# Altium schematic sheet NXP_USB_Programmer.SchDoc
size B
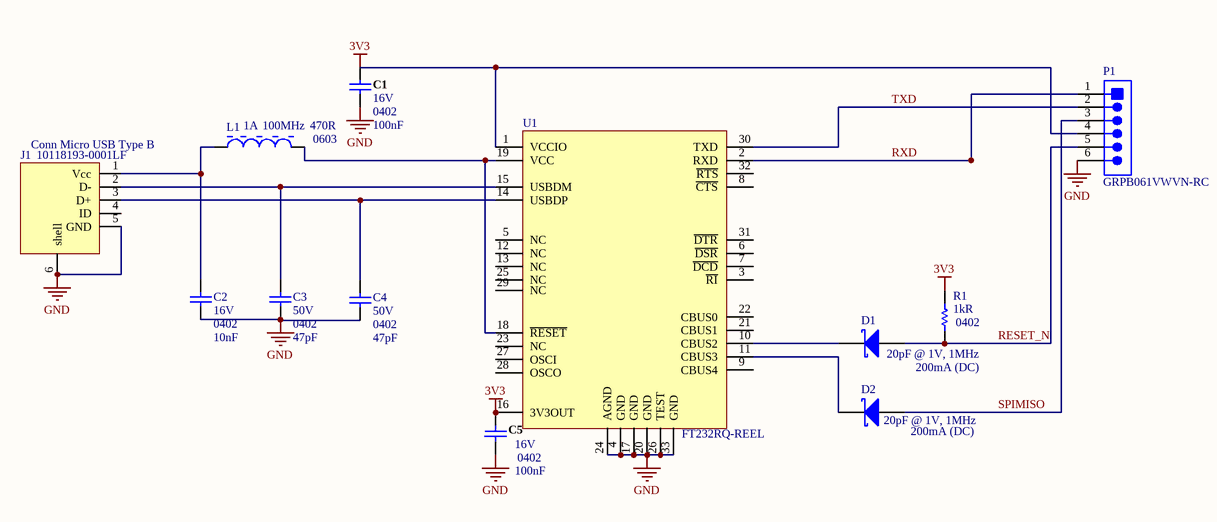
[diagram p0: NXP_USB_Programmer.SchDoc]

## Parts
C1  Voltage Rating: 16V  Case/Package: 0402  Capacitance: 100nF  [SM0402]  (hidden comment: CAP CER 0.1UF 16V X7R 0402)
C2  Voltage Rating: 16V  Case/Package: 0402  Capacitance: 10nF  [SM0402]  (hidden comment: CAP CER 10000PF 16V X7R 0402)
C3  Voltage Rating: 50V  Case/Package: 0402  Capacitance: 47pF  [SM0402]  (hidden comment: CAP CER 47PF 50V NP0 0402)
C4  Voltage Rating: 50V  Case/Package: 0402  Capacitance: 47pF  [SM0402]  (hidden comment: CAP CER 47PF 50V NP0 0402)
C5  Voltage Rating: 16V  Case/Package: 0402  Capacitance: 100nF  [SM0402]  (hidden comment: CAP CER 0.1UF 16V X7R 0402)
D1  Capacitance @ Vr, F: 20pF @ 1V, 1MHz  Current - Average Rectified (Io): 200mA (DC)  [DIODE SOD523]  (hidden comment: DIODE SCHOTTKY 30V 200MA SOD523)
D2  Capacitance @ Vr, F: 20pF @ 1V, 1MHz  Current - Average Rectified (Io): 200mA (DC)  [DIODE SOD523]  (hidden comment: DIODE SCHOTTKY 30V 200MA SOD523)
J1  Description2: Conn Micro USB Type B  [FCI-10118193-0001LF-5_V]  (hidden comment: 10118193-0001LF)
L1  Max Current Rating: 1A  Test Frequency: 100MHz  Impedance: 470R  Case/Package: 0603  [BLM18PG471SN1D]  (hidden comment: FERRITE BEAD 470 OHM 0603 1LN)
P1  CONN HEADER VERT 6POS 1.27MM  [SLIN-GRPB061VWVN-RC_V]  (value not drawn)
R1  Resistance: 1kR  Case/Package: 0402  [SM0402]  (hidden comment: RES 1K OHM 0.5% 1/16W 0402)
U1  FT232RQ-REEL  [COM-UART-FT232R-SQ32]

## Nets
3V3: C1.2 C5.2 P1.4 R1.2 U1.1(VCCIO) U1.16(3V3OUT)
GND: C1.1 C2.1 C3.1 C4.1 C5.1 J1.5(GND) J1.6(shell) P1.6 U1.4(GND) U1.17(GND) U1.20(GND) U1.24(AGND) U1.26(TEST) U1.33(GND)
RESET_N: D1.1(A) P1.5 R1.1
RXD: P1.1 U1.2(RXD)
SPIMISO: D2.1(A) P1.3
TXD: P1.2 U1.30(TXD)
NetC2_2: C2.2 J1.1(Vcc) L1.1
NetC3_2: C3.2 J1.2(D-) U1.15(USBDM)
NetC4_2: C4.2 J1.3(D+) U1.14(USBDP)
NetD1_2: D1.2(K) U1.10(CBUS2)
NetD2_2: D2.2(K) U1.11(CBUS3)
NetL1_2: L1.2 U1.18(~{RESET}) U1.19(VCC)

Not connected (* = marked no-connect by the designer): J1 4(ID); U1 3(~{RI}) 5(NC) 6(~{DSR}) 7(~{DCD}) 8(~{CTS}) 9(CBUS4) 12(NC) 13(NC) 21(CBUS1) 22(CBUS0) 23(NC) 25(NC) 27(OSCI) 28(OSCO) 29(NC) 31(~{DTR}) 32(~{RTS})

## Notes on the sheet
- Title
- Size:
- Date:
- B
- Number:
- Time:
- Revision:
- Sheet
- of
- File:

## Library data of the parts
C1 C5 = CC0402KRX7R7BB104: 0.1µF ±10% 16V Ceramic Capacitor X7R 0402 (1005 Metric); Manufacturer: Yageo; ComponentLink1Description: CC0402KRX7R7BB104; ComponentLink1URL: https://www.digikey.com/products/en/capacitors/ceramic-capacitors/60?k=CC0402KRX7R7BB104&k=&pkeyword=CC0402KRX7R7BB104&sv=0&pv7=2&sf=0&quantity=&ColumnSort=0&page=1&pageSize=25; ComponentLink2URL: https://datasheet.ciiva.com/11788/0900766b80ce67ed-11788364.pdf?src-supplier=RSComponents; ComponentLink2Description: https://datasheet.ciiva.com/11788/0900766b80ce67ed-11788364.pdf?src-supplier=RSComponents; ComponentLink3URL: https://datasheet.ciiva.com/16625/upy-gphc-x7r-6-3v-to-50v-8-16625511.pdf?src-supplier=Avnet+Europe; ComponentLink3Description: https://datasheet.ciiva.com/16625/upy-gphc-x7r-6-3v-to-50v-8-16625511.pdf?src-supplier=Avnet+Europe; ComponentLink4URL: https://datasheet.ciiva.com/161/mlccorderingcode-161544.pdf?src-supplier=Digi-Key; ComponentLink4Description: https://datasheet.ciiva.com/161/mlccorderingcode-161544.pdf?src-supplier=Digi-Key; ComponentLink5URL: https://datasheet.ciiva.com/161/mlccorderingcode-161545.pdf?src-supplier=Digi-Key; ComponentLink5Description: https://datasheet.ciiva.com/161/mlccorderingcode-161545.pdf?src-supplier=Digi-Key; ComponentLink6URL: https://datasheet.ciiva.com/11587/upy-gphc-x7r-6-3v-to-50v-8-11587305.pdf?src-supplier=Avnet; ComponentLink6Description: https://datasheet.ciiva.com/11587/upy-gphc-x7r-6-3v-to-50v-8-11587305.pdf?src-supplier=Avnet; ComponentLink7URL: https://datasheet.ciiva.com/161/mlccorderingcode-161546.pdf?src-supplier=Digi-Key; ComponentLink7Description: https://datasheet.ciiva.com/161/mlccorderingcode-161546.pdf?src-supplier=Digi-Key; ComponentLink8URL: https://datasheet.ciiva.com/13395/upy-gphc-x7r-6-3v-to-50v-8-13395676.pdf?src-supplier=Mouser; ComponentLink8Description: https://datasheet.ciiva.com/13395/upy-gphc-x7r-6-3v-to-50v-8-13395676.pdf?src-supplier=Mouser; ComponentLink9URL: https://datasheet.ciiva.com/8033/1734573-8033661.pdf?src-supplier=Element14; ComponentLink9Description: https://datasheet.ciiva.com/8033/1734573-8033661.pdf?src-supplier=Element14; ComponentLink10URL: https://datasheet.ciiva.com/7978/1489800-7978111.pdf?src-supplier=Element14; ComponentLink10Description: https://datasheet.ciiva.com/7978/1489800-7978111.pdf?src-supplier=Element14; ComponentLink11URL: https://datasheet.ciiva.com/8033/1734573-8033663.pdf?src-supplier=Element14; ComponentLink11Description: https://datasheet.ciiva.com/8033/1734573-8033663.pdf?src-supplier=Element14; ComponentLink12URL: https://datasheet.ciiva.com/28450/1489800-28450335.pdf?src-supplier=Element14; ComponentLink12Description: https://datasheet.ciiva.com/28450/1489800-28450335.pdf?src-supplier=Element14; Supplier 1: Digi-Key; Manufacturer Part Number: CC0402KRX7R7BB104; Stock 1: 38597495; Pricing 1: 1 = 0.10000, 10 = 0.03800, 100 = 0.01700, 500 = 0.01216, 1000 = 0.00956, 2500 = 0.00869, 5000 = 0.00799 (USD); Mount: Surface Mount; Number of Pins: 2; Case Code (Metric): 1005; Min Operating Temperature: -55°C; Max Operating Temperature: 125°C; Tolerance: 10%; Voltage Rating (DC): 16V; Packaging: Tape and Reel; Package Quantity: 1; Dielectric: X7R; Termination: SMD/SMT; Composition: Ceramic; Voltage: 16V; Length: 1mm; Height: 0.5mm; Width: 0.02inch; Thickness: 0.022inch; Depth: 0.5mm; Radiation Hardening: No; REACH SVHC: No SVHC; Lead Free: Lead Free; Halogen Free: Halogen Free; Case Code (Imperial): 0402; Supplier Part Number 1: 311-1338-1-ND
C2 = C0402C103K4RALTU: 10000pF ±10% 16V Ceramic Capacitor X7R 0402 (1005 Metric) /; Manufacturer: KEMET; Tolerance: Â±10%; Value: 10nF; Case-Metric: 1005; Description: Cap Ceramic 0.01uF 16V X7R 10% Pad SMD 0402 125C T/R; Dissipation Factor: 3.5%; Rated Voltage: 16 V; Case-EIA: 0402; Max Thickness: 0.6 mm; Technology: SMT; ComponentLink1Description: C0402C103K4RALTU; ComponentLink1URL: https://www.digikey.com/products/en/capacitors/ceramic-capacitors/60?k=C0402C103K4RALTU&k=&pkeyword=C0402C103K4RALTU&sv=0&pv7=2&sf=0&quantity=&ColumnSort=0&page=1&pageSize=25; Supplier 1: Digi-Key; Manufacturer Part Number: C0402C103K4RALTU; Stock 1: 75494; Pricing 1: 1 = 0.76000, 10 = 0.56400, 100 = 0.38640, 500 = 0.30590, 1000 = 0.25760, 2500 = 0.24150, 5000 = 0.23345 (USD); Mount: Surface Mount; Case Code (Metric): 1005; Dielectric Material: Ceramic; Min Operating Temperature: -55°C; Max Operating Temperature: 125°C; Packaging: Tape and Reel; Package Quantity: 1; Voltage Rating (DC): 16V; Dielectric: X7R; Termination: SMD/SMT; Length: 1mm; Height: 0.5mm; Width: 0.02inch; Thickness: 0.022inch; Depth: 0.5mm; Radiation Hardening: No; ComponentLink2URL: http://components.arrow.com/part/dataview/46124281S9906155N7429?src-supplier=Arrow; ComponentLink2Description: http://components.arrow.com/part/dataview/46124281S9906155N7429?src-supplier=Arrow; ComponentLink3URL: http://www.mouser.com/ds/2/212/KEM_C1018_X7R_SnPb_SMD-1102795.pdf?src-supplier=Mouser; ComponentLink3Description: http://www.mouser.com/ds/2/212/KEM_C1018_X7R_SnPb_SMD-1102795.pdf?src-supplier=Mouser; ComponentLink4URL: https://search.kemet.com/component-edge/download/datasheet/C0402C103K4RALTU.pdf?src-supplier=Digi-Key; ComponentLink4Description: https://search.kemet.com/component-edge/download/datasheet/C0402C103K4RALTU.pdf?src-supplier=Digi-Key; ComponentLink5URL: https://api.kemet.com/component-edge/download/datasheet/C0402C103K4RALTU.pdf?src-supplier=Digi-Key; ComponentLink5Description: https://api.kemet.com/component-edge/download/datasheet/C0402C103K4RALTU.pdf?src-supplier=Digi-Key; ComponentLink6URL: http://datasheet.octopart.com/C0402C103K4RALTU-Kemet-datasheet-62307648.pdf?src-supplier=Element14; ComponentLink6Description: http://datasheet.octopart.com/C0402C103K4RALTU-Kemet-datasheet-62307648.pdf?src-supplier=Element14; ComponentLink7URL: http://datasheet.octopart.com/C0402C103K4RALTU-KEMET-datasheet-83561409.pdf?src-supplier=Newark; ComponentLink7Description: http://datasheet.octopart.com/C0402C103K4RALTU-KEMET-datasheet-83561409.pdf?src-supplier=Newark; ComponentLink8URL: http://datasheet.octopart.com/C0402C103K4RALTU-KEMET-datasheet-86448208.pdf?src-supplier=Farnell; ComponentLink8Description: http://datasheet.octopart.com/C0402C103K4RALTU-KEMET-datasheet-86448208.pdf?src-supplier=Farnell; ComponentLink9URL: http://datasheet.octopart.com/C0402C103K4RALTU-KEMET-datasheet-84169754.pdf; ComponentLink9Description: http://datasheet.octopart.com/C0402C103K4RALTU-KEMET-datasheet-84169754.pdf; Case Code (Imperial): 0402; Supplier Part Number 1: 399-6340-1-ND
C3 C4 = C0402C470D5GACTU: 47pF ±0.5pF 50V Ceramic Capacitor C0G, NP0 0402 (1005 Metric); Manufacturer: KEMET; ComponentLink1Description: C0402C470D5GACTU; ComponentLink1URL: https://www.digikey.com/product-detail/en/C0402C470D5GACTU/C0402C470D5GACTU-ND/2196707?utm_campaign=buynow&WT.z_cid=ref_octopart_dkc_buynow&utm_medium=aggregator&curr=usd&site=us&utm_source=octopart; Supplier 1: Digi-Key; Manufacturer Part Number: C0402C470D5GACTU; Stock 1: 0; Pricing 1: 10000 = 0.39203 (USD); Mount: Surface Mount; Case Code (Metric): 1005; Dielectric Material: Ceramic; Min Operating Temperature: -55°C; Max Operating Temperature: 125°C; Package Quantity: 10000; Packaging: Tape and Reel; Voltage Rating (DC): 50V; Dielectric: C0G; Termination: SMD/SMT; Length: 0.039inch; Height: 0.5mm; Width: 0.02inch; Thickness: 0.022inch; Lead Pitch: 0.3mm; Lead Free: Lead Free; ComponentLink2URL: https://datasheet.ciiva.com/5421/kem-c1003-c0g-smd-5421883.pdf?src-supplier=Mouser; ComponentLink2Description: https://datasheet.ciiva.com/5421/kem-c1003-c0g-smd-5421883.pdf?src-supplier=Mouser; ComponentLink3URL: http://datasheet.octopart.com/C0402C470D5GACTU-KEMET-datasheet-84169754.pdf; ComponentLink3Description: http://datasheet.octopart.com/C0402C470D5GACTU-KEMET-datasheet-84169754.pdf; Supplier Part Number 1: C0402C470D5GACTU-ND; Case Code (Imperial): 0402
D1 D2 = RB521S30,115: Schottky Barrier Diode, 30 V, 0.2 A, -55 to 125 degC, 2-Pin SOD523F, RoHS, Tape and Reel; Manufacturer: Nexperia; ComponentLink1Description: RB521S30,115; ComponentLink1URL: https://www.digikey.com/product-detail/en/nexperia-usa-inc/RB521S30115/1727-6493-1-ND/2773925; ComponentLink2URL: http://datasheet.octopart.com/RB521S30%2C115-Nexperia-datasheet-87582339.pdf?src-supplier=Nexperia; ComponentLink2Description: http://datasheet.octopart.com/RB521S30%2C115-Nexperia-datasheet-87582339.pdf?src-supplier=Nexperia; ComponentLink3URL: http://datasheet.octopart.com/RB521S30%2C115-Nexperia-datasheet-10674343.pdf?src-supplier=NXP+Semiconductors; ComponentLink3Description: http://datasheet.octopart.com/RB521S30%2C115-Nexperia-datasheet-10674343.pdf?src-supplier=NXP+Semiconductors; ComponentLink4URL: http://datasheet.octopart.com/RB521S30%2C115-Philips-datasheet-14055121.pdf?src-supplier=IIIC; ComponentLink4Description: http://datasheet.octopart.com/RB521S30%2C115-Philips-datasheet-14055121.pdf?src-supplier=IIIC; Supplier 1: Digi-Key; Manufacturer Part Number: RB521S30,115; Stock 1: 15636; Pricing 1: 1 = 0.27000, 10 = 0.22100, 100 = 0.11740, 500 = 0.07726, 1000 = 0.05253 (USD); Supplier Part Number 1: 1727-6493-1-ND
J1 = 10118193-0001LF: USB - micro B USB 2.0 Receptacle Connector 5 Position Surface Mount, Right Angle; Through Hole; Manufacturer: Amphenol ICC; ComponentLink1Description: 609-4616-1-ND; ComponentLink1URL: https://www.digikey.com/products/en/connectors-interconnects/usb-dvi-hdmi-connectors/312?k=10118193-0001LF&k=&pkeyword=10118193-0001LF&sv=0&pv7=2&sf=0&quantity=&ColumnSort=0&page=1&pageSize=25; ComponentLink2URL: http://datasheet.octopart.com/10118193-0001LF-FCI-datasheet-55953155.pdf?src-supplier=TME; ComponentLink2Description: http://datasheet.octopart.com/10118193-0001LF-FCI-datasheet-55953155.pdf?src-supplier=TME; ComponentLink3URL: http://datasheet.octopart.com/10118193-0001LF-FCI-datasheet-11792339.pdf?src-supplier=Arrow; ComponentLink3Description: http://datasheet.octopart.com/10118193-0001LF-FCI-datasheet-11792339.pdf?src-supplier=Arrow; ComponentLink4URL: http://datasheet.octopart.com/10118193-0001LF-FCI-datasheet-13702206.pdf?src-supplier=Allied+Electronics; ComponentLink4Description: http://datasheet.octopart.com/10118193-0001LF-FCI-datasheet-13702206.pdf?src-supplier=Allied+Electronics; ComponentLink5URL: http://datasheet.octopart.com/10118193-0001LF-Amphenol-datasheet-96019471.pdf?src-supplier=Newark; ComponentLink5Description: http://datasheet.octopart.com/10118193-0001LF-Amphenol-datasheet-96019471.pdf?src-supplier=Newark; ComponentLink6URL: http://datasheet.octopart.com/10118193-0001LF-Amphenol-ICC-datasheet-96019471.pdf?src-supplier=Element14; ComponentLink6Description: http://datasheet.octopart.com/10118193-0001LF-Amphenol-ICC-datasheet-96019471.pdf?src-supplier=Element14; ComponentLink7URL: http://datasheet.octopart.com/10118193-0001LF-Amphenol-ICC-datasheet-55953155.pdf?src-supplier=Future+Electronics; ComponentLink7Description: http://datasheet.octopart.com/10118193-0001LF-Amphenol-ICC-datasheet-55953155.pdf?src-supplier=Future+Electronics; ComponentLink8URL: http://datasheet.octopart.com/10118193-0001LF-Amphenol-ICC-datasheet-116246833.pdf?src-supplier=Future+Electronics; ComponentLink8Description: http://datasheet.octopart.com/10118193-0001LF-Amphenol-ICC-datasheet-116246833.pdf?src-supplier=Future+Electronics; ComponentLink9URL: http://datasheet.octopart.com/10118193-0001LF-ICC-datasheet-96019471.pdf?src-supplier=Farnell; ComponentLink9Description: http://datasheet.octopart.com/10118193-0001LF-ICC-datasheet-96019471.pdf?src-supplier=Farnell; ComponentLink10URL: http://datasheet.octopart.com/10118193-0001LF-ICC-datasheet-55953155.pdf?src-supplier=Farnell; ComponentLink10Description: http://datasheet.octopart.com/10118193-0001LF-ICC-datasheet-55953155.pdf?src-supplier=Farnell; Supplier 1: Arrow Electronics Inc.; Stock 1: 8400; Pricing 1: 1200 = 0.20150, 2400 = 0.18370, 4800 = 0.17130, 9600 = 0.15910, 24000 = 0.15810, 1 = 0.42060, 10 = 0.30000, 25 = 0.29990, 100 = 0.28820, 250 = 0.28160, 500 = 0.24750, 1000 = 0.24300, 3000 = 0.19000, 6000 = 0.17370 (USD); Supplier Part Number 1: 10118193-0001LF; Manufacturer Part Number: 10118193-0001LF
L1 = BLM18PG471SN1D: 470 Ohms @ 100MHz 1 Power Line Ferrite Bead 0603 (1608 Metric) 1A 200mOhm; Manufacturer: Murata; Material: Steel; Tolerance: 25%; Resistance: 200mR; Number of Lines: 1; ComponentLink2Description: Datasheet; ComponentLink3URL: http://www.murata.com/products/catalog/pdf/c31e.pdf; ComponentLink1URL: http://www.murata.com/; ComponentLink3Description: Package Specification; ComponentLink2URL: http://www.murata.com/products/catalog/pdf/c31e.pdf; ComponentLink1Description: Manufacturer URL; ComponentLink4Description: BLM18PG471SN1D; ComponentLink4URL: https://www.digikey.com/products/en/filters/ferrite-beads-and-chips/841?k=BLM18PG471SN1D&k=&pkeyword=BLM18PG471SN1D&sv=0&pv7=2&sf=0&quantity=&ColumnSort=0&page=1&pageSize=25; Supplier 1: Digi-Key; Manufacturer Part Number: BLM18PG471SN1D; Stock 1: 2280; Pricing 1: 1 = 0.10000, 10 = 0.07600, 25 = 0.06840, 50 = 0.05000, 100 = 0.04330, 250 = 0.03416, 500 = 0.02884, 1000 = 0.02429 (USD); Number of Pins: 2; Core Material: Ferrite; Case Code (Metric): 1608; Case Code (Imperial): 0603; Min Operating Temperature: -55°C; Max Operating Temperature: 125°C; Package Quantity: 1; Packaging: Tape and Reel; Current Rating: 1A; Max DC Current: 1A; DC Resistance (DCR): 200mR; Termination: SMD/SMT; DC Current: 1A; Military Standard: Not; Number of Circuits: 1; Length: 1.6mm; Height: 0.8mm; Width: 0.8mm; Depth: 0.8mm; Radiation Hardening: No; REACH SVHC: No SVHC; Lead Free: Lead Free; ComponentLink5URL: https://datasheet.ciiva.com/11800/0900766b81275ca5-11800885.pdf?src-supplier=RSComponents; ComponentLink5Description: https://datasheet.ciiva.com/11800/0900766b81275ca5-11800885.pdf?src-supplier=RSComponents; ComponentLink6URL: https://datasheet.ciiva.com/8021/1740433-8021497.pdf?src-supplier=Element14; ComponentLink6Description: https://datasheet.ciiva.com/8021/1740433-8021497.pdf?src-supplier=Element14; ComponentLink7URL: https://datasheet.ciiva.com/6212/l0110s0100blm18p-6212508.pdf?src-supplier=Digi-Key; ComponentLink7Description: https://datasheet.ciiva.com/6212/l0110s0100blm18p-6212508.pdf?src-supplier=Digi-Key; ComponentLink8URL: https://datasheet.ciiva.com/6212/l0110s0100blm18p-6212509.pdf?src-supplier=Digi-Key; ComponentLink8Description: https://datasheet.ciiva.com/6212/l0110s0100blm18p-6212509.pdf?src-supplier=Digi-Key; ComponentLink9URL: https://datasheet.ciiva.com/16331/l0110s0100blm18p-16331542.pdf?src-supplier=Future+Electronics; ComponentLink9Description: https://datasheet.ciiva.com/16331/l0110s0100blm18p-16331542.pdf?src-supplier=Future+Electronics; ComponentLink10URL: https://datasheet.ciiva.com/6212/l0110s0100blm18p-6212506.pdf?src-supplier=Digi-Key; ComponentLink10Description: https://datasheet.ciiva.com/6212/l0110s0100blm18p-6212506.pdf?src-supplier=Digi-Key; ComponentLink11URL: https://datasheet.ciiva.com/8021/1740433-8021498.pdf?src-supplier=Element14; ComponentLink11Description: https://datasheet.ciiva.com/8021/1740433-8021498.pdf?src-supplier=Element14; ComponentLink12URL: https://datasheet.ciiva.com/14122/blm-series-eng-tds-14122876.pdf?src-supplier=Distrelec; ComponentLink12Description: https://datasheet.ciiva.com/14122/blm-series-eng-tds-14122876.pdf?src-supplier=Distrelec; ComponentLink13URL: https://datasheet.ciiva.com/8508/l0110s0100blm18p-8508303.pdf?src-supplier=Avnet; ComponentLink13Description: https://datasheet.ciiva.com/8508/l0110s0100blm18p-8508303.pdf?src-supplier=Avnet; ComponentLink14URL: http://datasheet.octopart.com/BLM18PG471SN1D-Murata-datasheet-11754816.pdf?src-supplier=Element14; ComponentLink14Description: http://datasheet.octopart.com/BLM18PG471SN1D-Murata-datasheet-11754816.pdf?src-supplier=Element14; ComponentLink15URL: http://datasheet.octopart.com/BLM18PG471SN1D-Murata-datasheet-8326388.pdf?src-supplier=_legacy+Avnet; ComponentLink15Description: http://datasheet.octopart.com/BLM18PG471SN1D-Murata-datasheet-8326388.pdf?src-supplier=_legacy+Avnet; ComponentLink16URL: http://datasheet.octopart.com/BLM18PG471SN1D-Murata-datasheet-503348.pdf?src-supplier=_legacy+Avnet; ComponentLink16Description: http://datasheet.octopart.com/BLM18PG471SN1D-Murata-datasheet-503348.pdf?src-supplier=_legacy+Avnet; ComponentLink17URL: http://datasheet.octopart.com/BLM18PG471SN1D-Murata-datasheet-35449.pdf?src-supplier=Farnell; ComponentLink17Description: http://datasheet.octopart.com/BLM18PG471SN1D-Murata-datasheet-35449.pdf?src-supplier=Farnell; ComponentLink18URL: http://datasheet.octopart.com/BLM18PG471SN1D-Murata-datasheet-62086344.pdf?src-supplier=Future+Electronics; ComponentLink18Description: http://datasheet.octopart.com/BLM18PG471SN1D-Murata-datasheet-62086344.pdf?src-supplier=Future+Electronics; ComponentLink19URL: http://datasheet.octopart.com/BLM18PG471SN1D-Murata-datasheet-62117746.pdf?src-supplier=TME; ComponentLink19Description: http://datasheet.octopart.com/BLM18PG471SN1D-Murata-datasheet-62117746.pdf?src-supplier=TME; ComponentLink20URL: http://datasheet.octopart.com/BLM18PG471SN1D-Murata-datasheet-37129980.pdf; ComponentLink20Description: http://datasheet.octopart.com/BLM18PG471SN1D-Murata-datasheet-37129980.pdf; Supplier Part Number 1: 490-5223-1-ND
P1 = GRPB061VWVN-RC: Connector Header Through Hole 6 position 0.050" (1.27mm); Manufacturer: Sullins; Number of Positions: 6; Connector Type: Male Pin; Pitch: 0.05inch; ComponentLink1Description: GRPB061VWVN-RC; ComponentLink1URL: https://www.digikey.com/products/en?keywords=GRPB061VWVN-RC; Supplier 1: Digi-Key; Stock 1: 23780; Pricing 1: 1 = 0.48000, 10 = 0.44800, 100 = 0.34360, 500 = 0.29880, 1000 = 0.24651, 5000 = 0.21663, 10000 = 0.21580 (USD); Mount: Through Hole; Contact Plating: Gold; Package Quantity: 1; Number of Rows: 1; Packaging: Bulk; Termination: Solder; Contact Mating Length: 0.118inch; Lead Free: Lead Free; ComponentLink2URL: https://datasheet.ciiva.com/726/71-grpb-1vwvn-rc-10957-c-726652.pdf?src-supplier=Digi-Key; ComponentLink2Description: https://datasheet.ciiva.com/726/71-grpb-1vwvn-rc-10957-c-726652.pdf?src-supplier=Digi-Key; ComponentLink3URL: http://datasheet.octopart.com/GRPB061VWVN-RC-Sullins-datasheet-12514290.pdf?src-supplier=Future+Electronics; ComponentLink3Description: http://datasheet.octopart.com/GRPB061VWVN-RC-Sullins-datasheet-12514290.pdf?src-supplier=Future+Electronics; ComponentLink4URL: http://datasheet.octopart.com/GRPB061VWVN-RC-Sullins-datasheet-34148777.pdf?src-supplier=Future+Electronics; ComponentLink4Description: http://datasheet.octopart.com/GRPB061VWVN-RC-Sullins-datasheet-34148777.pdf?src-supplier=Future+Electronics; Supplier Part Number 1: S9014E-06-ND; Manufacturer Part Number: GRPB061VWVN-RC
R1 = RNCF0402DTE1K00: 1 kOhms ±0.5% 0.063W, 1/16W Chip Resistor 0402 (1005 Metric) Automotive AEC-Q200 Thin Film; Manufacturer: Stackpole Electronics; Tolerance: 1 %; Value: 1000.00 Ohm; Case-Metric: 1005; Power Rating: 63mW; Case-EIA: 0402; Technology: SMT; Power: 0.063 W; ComponentLink1Description: RNCF0402DTE1K00; ComponentLink1URL: https://www.digikey.com/products/en/resistors/chip-resistor-surface-mount/52?k=RNCF0402DTE1K00&k=&pkeyword=RNCF0402DTE1K00&sv=0&pv7=2&sf=0&quantity=&ColumnSort=0&page=1&pageSize=25; Supplier 1: Digi-Key; Manufacturer Part Number: RNCF0402DTE1K00; Stock 1: 17585; Pricing 1: 1 = 0.13000, 10 = 0.12000, 100 = 0.04620, 1000 = 0.02033, 2500 = 0.01756, 5000 = 0.01571 (USD); RoHS: No; Mount: Surface Mount; Min Operating Temperature: -55°C; Max Operating Temperature: 155°C; Packaging: Tape and Reel; Supplier Part Number 1: RNCF0402DTE1K00CT-ND
U1 = COM-UART-FT232R-SQ32: USB Bridge, USB to UART USB 2.0 UART Interface 32-QFN (5x5); Manufacturer: FTDI; Operating Supply Voltage: 5V; Number of Channels: 1; Max Supply Voltage: 5.25V; Min Supply Voltage: 3.3V; Data Rate: 12Mbps; Operating Supply Current: 15mA; ComponentLink1Description: FT232RQ-REEL; ComponentLink1URL: https://www.digikey.com/products/en/integrated-circuits-ics/interface-controllers/753?k=FT232R&k=&pkeyword=FT232R&sv=0&pv16=4404&sf=0&FV=ffe002f1%2C1c0002%2C1c0006&quantity=&ColumnSort=0&page=1&pageSize=25; Supplier 1: Digi-Key; Stock 1: 57058; Pricing 1: 1 = 4.50000, 10 = 4.05000, 50 = 3.85000, 100 = 3.65000, 250 = 3.25000, 500 = 2.85002, 1000 = 2.65000, 2500 = 2.35000 (USD); Mount: Surface Mount; Case/Package: QFN EP; Number of Pins: 32; Weight: 0.006653oz; Min Operating Temperature: -40°C; Max Operating Temperature: 85°C; Packaging: Tape and Reel; Package Quantity: 6000; Interface: UART; Length: 5mm; Width: 5mm; Radiation Hardening: No; Lead Free: Lead Free; ComponentLink2URL: https://datasheet.ciiva.com/1505/1647396-1505445.pdf?src-supplier=Digi-Key; ComponentLink2Description: https://datasheet.ciiva.com/1505/1647396-1505445.pdf?src-supplier=Digi-Key; ComponentLink3URL: https://datasheet.ciiva.com/26841/ft232rq-reel-26841082.pdf?src-supplier=IIIC; ComponentLink3Description: https://datasheet.ciiva.com/26841/ft232rq-reel-26841082.pdf?src-supplier=IIIC; ComponentLink4URL: https://datasheet.ciiva.com/1787/ds-ft232r-1787041.pdf?src-supplier=Digi-Key; ComponentLink4Description: https://datasheet.ciiva.com/1787/ds-ft232r-1787041.pdf?src-supplier=Digi-Key; ComponentLink5URL: https://datasheet.ciiva.com/1787/ds-ft232r-1787042.pdf?src-supplier=Digi-Key; ComponentLink5Description: https://datasheet.ciiva.com/1787/ds-ft232r-1787042.pdf?src-supplier=Digi-Key; ComponentLink6URL: https://datasheet.ciiva.com/16438/ds-ft232r-16438555.pdf?src-supplier=Future+Electronics; ComponentLink6Description: https://datasheet.ciiva.com/16438/ds-ft232r-16438555.pdf?src-supplier=Future+Electronics; ComponentLink7URL: https://datasheet.ciiva.com/15150/getdatasheetpartid-644721-15150509.pdf?src-supplier=Verical; ComponentLink7Description: https://datasheet.ciiva.com/15150/getdatasheetpartid-644721-15150509.pdf?src-supplier=Verical; ComponentLink8URL: https://datasheet.ciiva.com/4787/ds-ft232r-4787663.pdf?src-supplier=Mouser; ComponentLink8Description: https://datasheet.ciiva.com/4787/ds-ft232r-4787663.pdf?src-supplier=Mouser; ComponentLink9URL: http://datasheet.octopart.com/FT232RQ-REEL-FTDI-datasheet-11992319.pdf?src-supplier=Allied+Electronics; ComponentLink9Description: http://datasheet.octopart.com/FT232RQ-REEL-FTDI-datasheet-11992319.pdf?src-supplier=Allied+Electronics; ComponentLink10URL: http://datasheet.octopart.com/FT232RQ-REEL-FTDI-datasheet-44209889.pdf?src-supplier=Newark; ComponentLink10Description: http://datasheet.octopart.com/FT232RQ-REEL-FTDI-datasheet-44209889.pdf?src-supplier=Newark; ComponentLink11URL: http://datasheet.octopart.com/FT232RQ-REEL-FTDI-datasheet-10427816.pdf?src-supplier=Arrow; ComponentLink11Description: http://datasheet.octopart.com/FT232RQ-REEL-FTDI-datasheet-10427816.pdf?src-supplier=Arrow; ComponentLink12URL: http://datasheet.octopart.com/FT232RQ-REEL-FTDI-datasheet-15949903.pdf?src-supplier=IIIC; ComponentLink12Description: http://datasheet.octopart.com/FT232RQ-REEL-FTDI-datasheet-15949903.pdf?src-supplier=IIIC; ComponentLink13URL: http://datasheet.octopart.com/FT232RQ-REEL-FTDI-datasheet-68321328.pdf?src-supplier=TME; ComponentLink13Description: http://datasheet.octopart.com/FT232RQ-REEL-FTDI-datasheet-68321328.pdf?src-supplier=TME; Supplier Part Number 1: 768-1008-1-ND; Manufacturer Part Number: FT232RQ-REEL